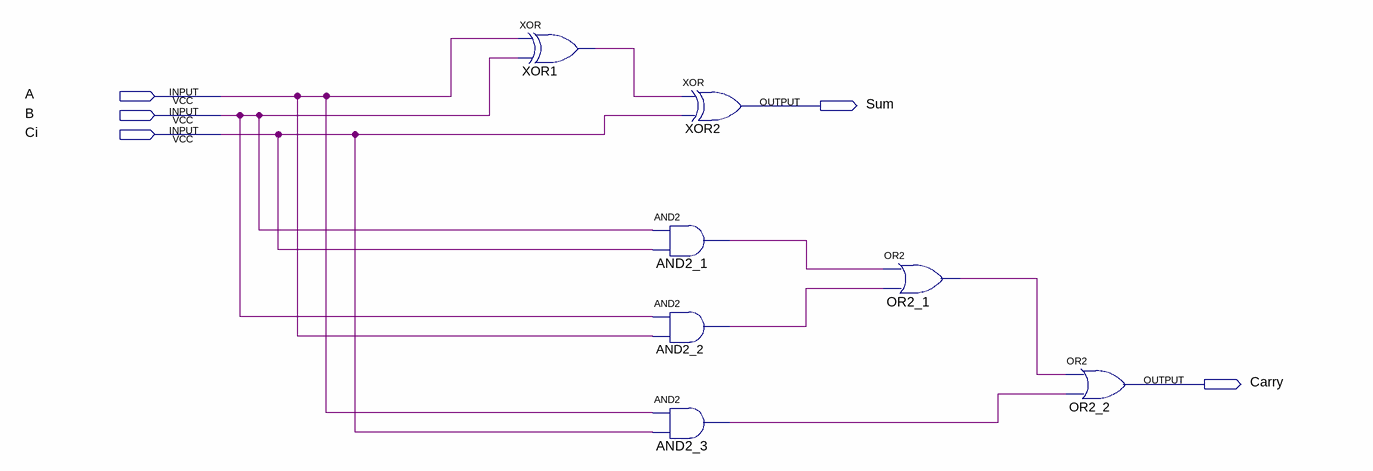
[diagram p0: schematic sheet]
// Quartus schematic Full_Adder.bdf as structural Verilog: 7 symbols, 5 pins
module Full_Adder (
  input  A,
  input  B,
  input  Ci,
  output Sum,
  output Carry
);

  wire AND2_1_out, AND2_2_out, AND2_3_out, OR2_1_out, XOR1_out;

  xor XOR1 (XOR1_out, A, B);
  xor XOR2 (Sum, XOR1_out, Ci);
  and AND2_1 (AND2_1_out, B, Ci);
  and AND2_2 (AND2_2_out, B, A);
  and AND2_3 (AND2_3_out, A, Ci);
  or OR2_1 (OR2_1_out, AND2_1_out, AND2_2_out);
  or OR2_2 (Carry, OR2_1_out, AND2_3_out);
endmodule
